# Altium project AWH6_V10.PrjPcb (part 3 of 3)
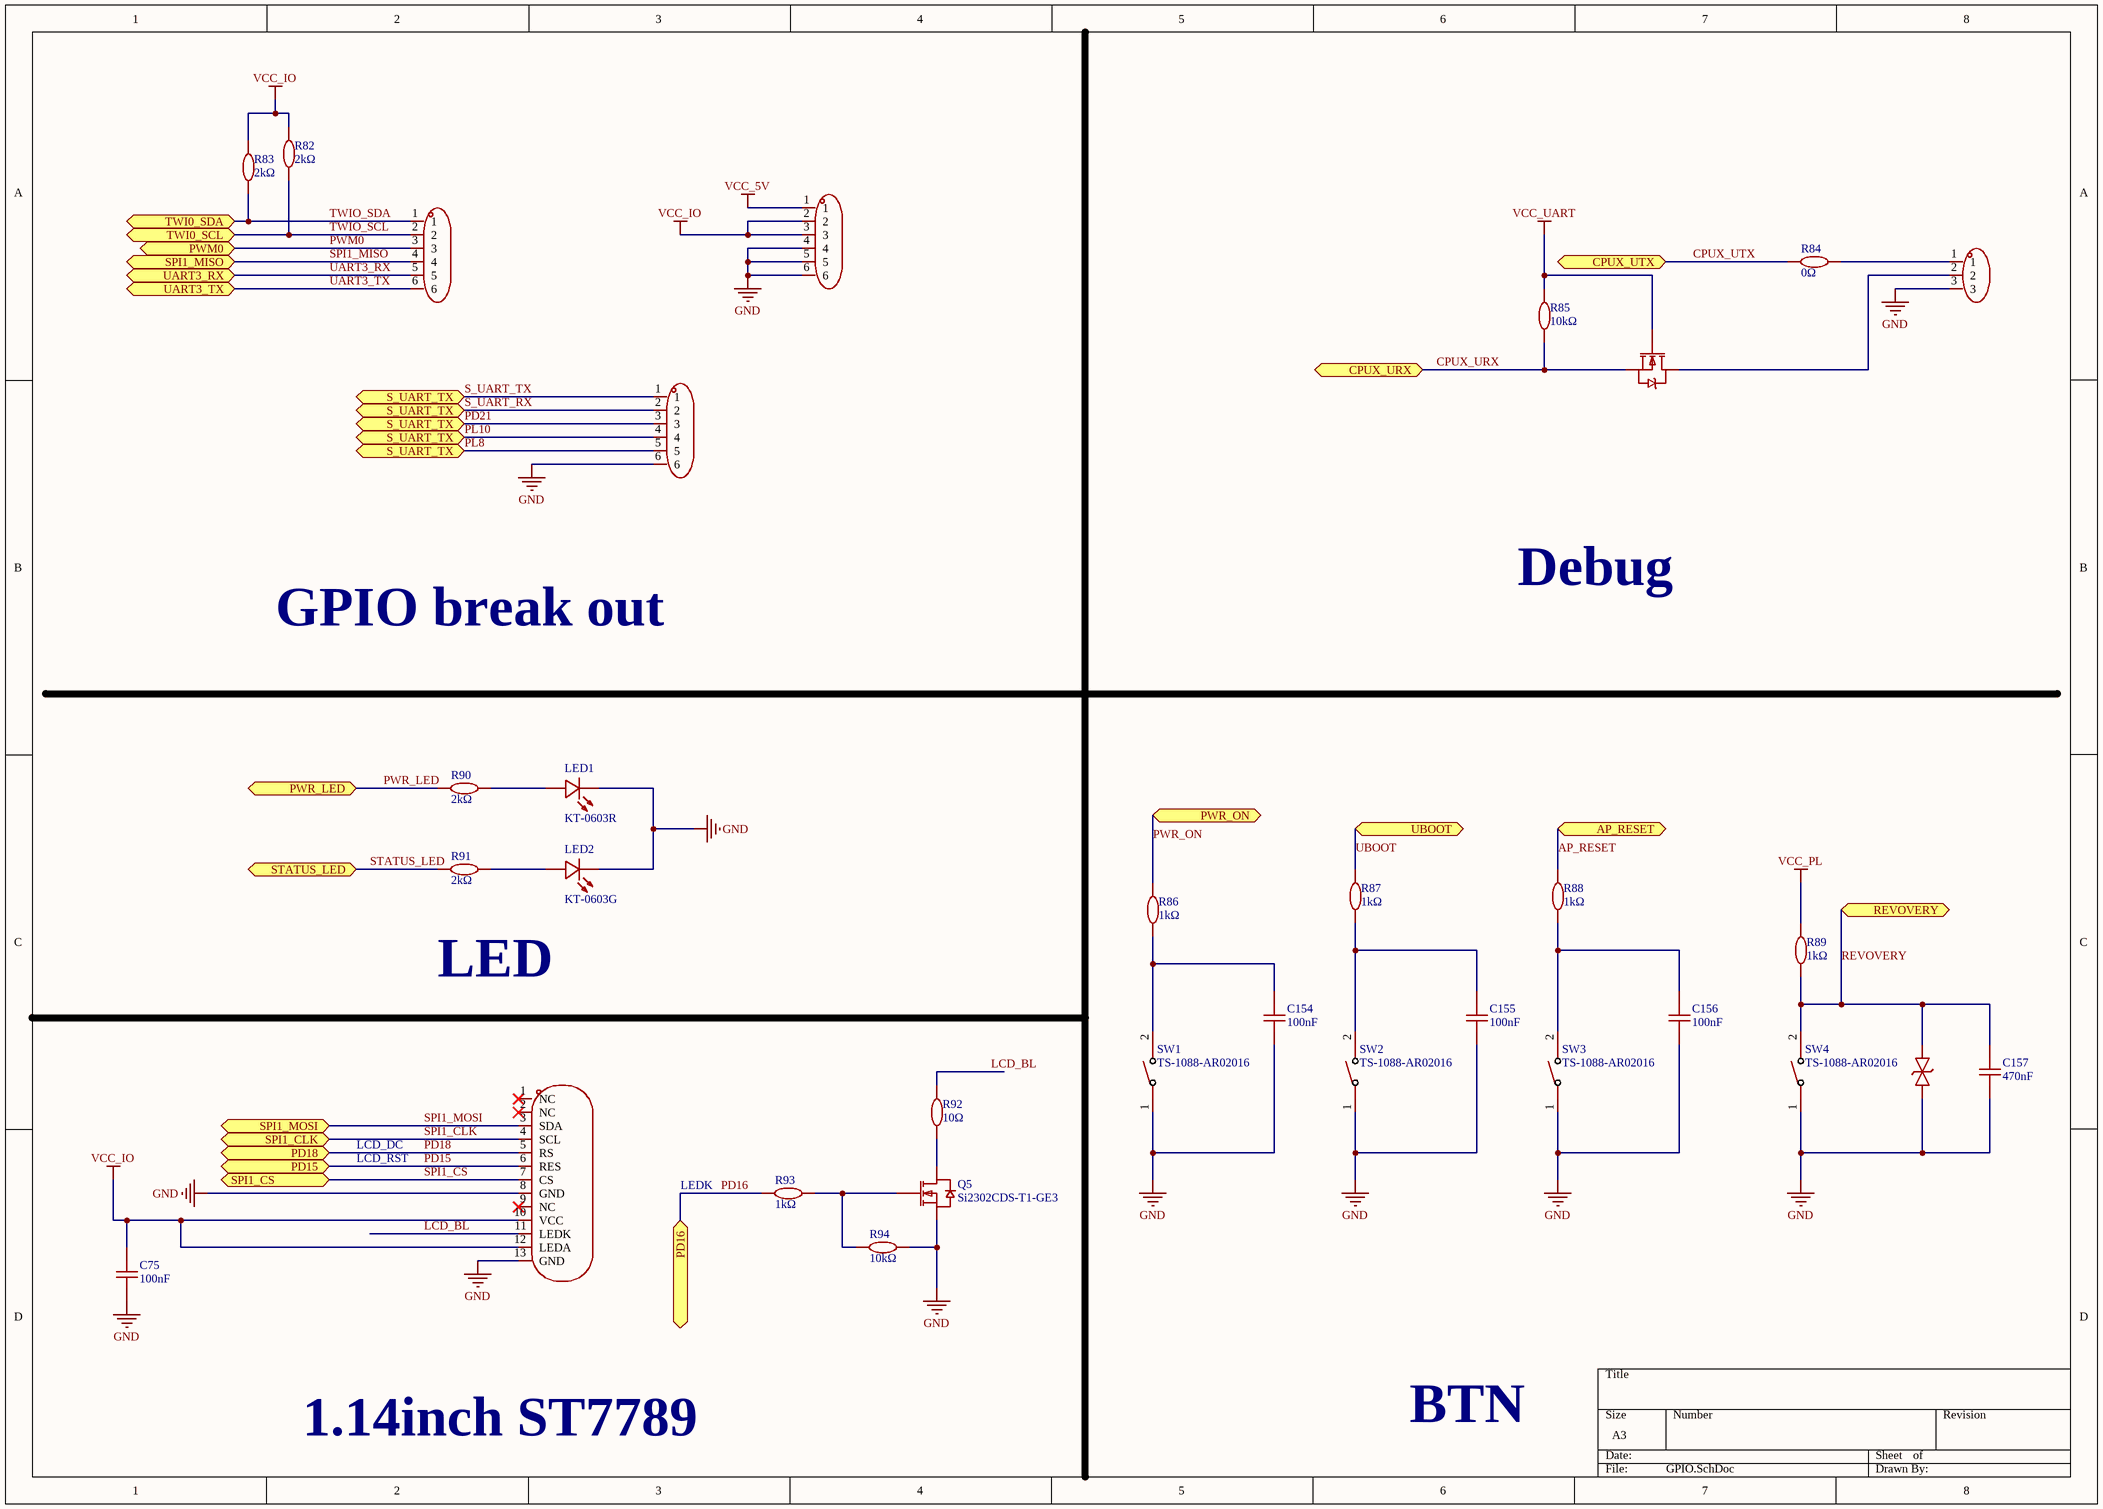
[diagram p10: GPIO.SchDoc]

## Nets that join several sheets
ALDO1: SoC_1 (C99.2 U2.H18), Power (5 pins), GPIO (R89.2)
ALDO2: Power (C66.2 U4.31), SoC_2 (10 pins)
ALDO3: SoC_1 (R70.1 U2.R6), eMMC (6 pins), Power (5 pins), TF-USB (R53.2), Audio-HDMI (5 pins), SoC_2 (5 pins), GPIO (9 pins)
BLDO1: LPDDR3 (12 pins), Power (C72.2 U4.2), SoC_2 (6 pins)
BLDO2: Power (C73.2 R49.1 U4.1), SoC_2 (5 pins)
GND: LPDDR3 (93 pins), SoC_1 (5 pins), eMMC (18 pins), Power (49 pins), TF-USB (47 pins), Audio-HDMI (21 pins), Wi-Fi (29 pins), SoC_2 (209 pins), GPIO (21 pins)
PS: Power (27 pins), TF-USB (9 pins), Audio-HDMI (D4.2), Wi-Fi (C90.2 C91.2 U30.4), GPIO (U12.1)
VCC18_RTC: Power (5 pins), SoC_2 (C149.2 R75.1 U2.F20)
VCC33_WIFI: Power (R51.1), Wi-Fi (6 pins)
VCC_DCXOIO: SoC_1 (C98.2 C100.2 U2.H6 U2.M19), Power (R47.1 R50.1), Wi-Fi (13 pins), SoC_2 (C126.2 U2.A22)
VCC_PC: SoC_1 (C97.2 U2.N19), eMMC (8 pins), Power (R48.1 R49.2)
VDD09_HDMI: Power (C69.2 L5.2 U4.9), SoC_2 (19 pins)
VDD18_LPDDR: LPDDR3 (C19.2 C20.2), Power (R39.2)
VDD_CPU: Power (C56.2 C61.2 L2.2 L3.2), SoC_2 (15 pins)
VDD_GPU: Power (C63.2 L4.2), SoC_2 (13 pins)
AP_CK32KO: Wi-Fi (R29.2 R30.2), SoC_2 (U2.G20)
AP_NMI: Power (R43.2 U4.16), SoC_2 (C102.2 U2.G21)
AP_RESET: Power (C57.2 U4.15), SoC_2 (C103.2 R75.2 U2.G22 U32.2), GPIO (R88.2)
AP_WAKE_BT: SoC_1 (U2.L22), Wi-Fi (R31.2 U6.6)
BT_PCM_CLK: SoC_1 (U2.K2), Wi-Fi (U6.26)
BT_PCM_DIN: SoC_1 (U2.L3), Wi-Fi (U6.27)
BT_PCM_DOUT: SoC_1 (U2.L4), Wi-Fi (U6.25)
BT_PCM_SYNC: SoC_1 (U2.K3), Wi-Fi (U6.28)
BT_REG_ON: SoC_1 (U2.L19), Wi-Fi (R23.2 R32.2)
BT_UART_CTS: SoC_1 (U2.H3), Wi-Fi (R18.1 U6.44)
BT_UART_RTS: SoC_1 (U2.K1), Wi-Fi (R21.1 U6.41)
BT_UART_RX: SoC_1 (U2.H4), Wi-Fi (R19.1 U6.43)
BT_UART_TX: SoC_1 (U2.J6), Wi-Fi (R20.1 U6.42)
BT_WAKE_AP: SoC_1 (U2.L21), Wi-Fi (U6.7)
CPUX_URX: SoC_1 (U2.D12), GPIO (Q4.2 R85.1)
CPUX_UTX: SoC_1 (U2.C9), GPIO (R84.1)
DDC_CEC_EN: SoC_1 (U2.E11), Audio-HDMI (R12.1)
EMMC_CLK: SoC_1 (C43.2 R34.1), eMMC (U3.M6)
EMMC_CMD: SoC_1 (U2.M21), eMMC (R37.1 U3.M5)
EMMC_D0: SoC_1 (U2.N22), eMMC (U3.A3)
EMMC_D1: SoC_1 (U2.N23), eMMC (U3.A4)
EMMC_D2: SoC_1 (U2.R22), eMMC (U3.A5)
EMMC_D3: SoC_1 (U2.R23), eMMC (U3.B2)
EMMC_D4: SoC_1 (U2.T22), eMMC (U3.B3 U3.C3)
EMMC_D5: SoC_1 (U2.T21), eMMC (U3.B4)
EMMC_D6: SoC_1 (U2.U19), eMMC (U3.B5 U3.C5)
EMMC_D7: SoC_1 (U2.U21), eMMC (U3.B6)
EMMC_DS: SoC_1 (U2.R20), eMMC (R38.2 U3.H5)
EMMC_RST: SoC_1 (R36.1), eMMC (U3.K5)
HCEC: SoC_1 (U2.E9), Audio-HDMI (Q3.2 R16.1)
HHPD: Audio-HDMI (C35.2 R15.1), SoC_2 (U2.C20)
HOST3_N: TF-USB (U24.2 USB1.2), SoC_2 (U2.A12)
HOST3_P: TF-USB (U25.2 USB1.3), SoC_2 (U2.B12)
HSCL: SoC_1 (U2.E10), Audio-HDMI (Q1.2 R10.1)
HSDA: SoC_1 (U2.F7), Audio-HDMI (Q2.2 R13.1)
HTX0_N: Audio-HDMI (CN1.9 D2.2 D2.9), SoC_2 (U2.B19)
HTX0_P: Audio-HDMI (CN1.7 D2.1 D2.10), SoC_2 (U2.A19)
HTX1_N: Audio-HDMI (CN1.6 D1.5 D1.6), SoC_2 (U2.B18)
HTX1_P: Audio-HDMI (CN1.4 D1.4 D1.7), SoC_2 (U2.A18)
HTX2_N: Audio-HDMI (CN1.3 D1.2 D1.9), SoC_2 (U2.B17)
HTX2_P: Audio-HDMI (CN1.1 D1.1 D1.10), SoC_2 (U2.A17)
HTXC_N: Audio-HDMI (CN1.12 D2.5 D2.6), SoC_2 (U2.B20)
HTXC_P: Audio-HDMI (CN1.10 D2.4 D2.7), SoC_2 (U2.A20)
LINEOUTL: Audio-HDMI (C34.2), SoC_2 (U2.D2)
LINEOUTR: Audio-HDMI (C33.2), SoC_2 (U2.D1)
PD15: SoC_1 (U2.R3), GPIO (LCD1.6)
PD16: SoC_1 (U2.R2), GPIO (R93.2)
PD18: SoC_1 (U2.P4), GPIO (LCD1.5)
PD21: SoC_1 (5 pins), GPIO (5 pins)
PMU_SCK: SoC_1 (U2.K20), Power (R45.1 U4.23)
PMU_SDA: SoC_1 (U2.K23), Power (R44.1 U4.24)
PWM0: SoC_1 (U2.U2), GPIO (U33.3)
PWR_LED: SoC_1 (U2.K21), GPIO (R90.1)
PWR_ON: Power (U4.27), GPIO (R86.2)
REVOVERY: SoC_1 (U2.J22), GPIO (C157.2 R89.1 SW4.2 U35.2)
SDC0_CLK: SoC_1 (R33.2), TF-USB (U5.5 U21.2)
SDC0_CMD: SoC_1 (U2.G3), TF-USB (R52.1 U5.3 U20.2)
SDC0_D0: SoC_1 (U2.F3), TF-USB (U5.7 U16.2)
SDC0_D1: SoC_1 (U2.E2), TF-USB (U5.8 U17.2)
SDC0_D2: SoC_1 (U2.G2), TF-USB (U5.1 U18.2)
SDC0_D3: SoC_1 (U2.F1), TF-USB (U5.2 U19.2)
SDC0_DET: SoC_1 (U2.C8), TF-USB (R56.1 U5.9 U22.2)
SPI1_CLK: SoC_1 (U2.E12), GPIO (LCD1.4)
SPI1_CS: SoC_1 (U2.D11), GPIO (LCD1.7)
SPI1_MISO: SoC_1 (U2.D9), GPIO (U33.4)
SPI1_MOSI: SoC_1 (U2.F9), GPIO (LCD1.3)
STATUS_LED: SoC_1 (U2.J21), GPIO (R91.1)
TWIO_SCL: SoC_1 (U2.U3), GPIO (R82.1 U33.2)
TWIO_SDA: SoC_1 (U2.R5), GPIO (R83.1 U33.1)
UART3_RX: SoC_1 (U2.V1), GPIO (U33.5)
UART3_TX: SoC_1 (U2.U5), GPIO (U33.6)
UBOOT: SoC_2 (U2.G17), GPIO (R87.2)
USB0_DRVVBUS: SoC_1 (U2.H20), TF-USB (R54.1 R57.2 U13.4)
USB0_N: TF-USB (U15.2 USB2.2), SoC_2 (U2.A13)
USB0_P: TF-USB (U14.2 USB2.3), SoC_2 (U2.B13)
USB1_N: TF-USB (U27.2 USB1.11), SoC_2 (U2.B16)
USB1_P: TF-USB (U28.2 USB1.12), SoC_2 (U2.C16)
USB1_SSRX_N: TF-USB (D6.1 D6.10 USB1.14), SoC_2 (U2.A14)
USB1_SSRX_P: TF-USB (D6.2 D6.9 USB1.15), SoC_2 (U2.B14)
USB1_SSTX_N: TF-USB (D6.4 D6.7 USB1.17), SoC_2 (C44.1)
USB1_SSTX_P: TF-USB (D6.5 D6.6 USB1.18), SoC_2 (C45.1)
VDD_CPUFB: Power (U4.39 U4.40), SoC_2 (U2.R16 U2.T17)
VDD_GPUFB: Power (U4.47), SoC_2 (U2.R7)
WIFI_PWR_EN: SoC_1 (U2.F8), Wi-Fi (R66.1)
WL_REG_ON: SoC_1 (U2.M22), Wi-Fi (R22.2 U6.12)
WL_SDIO_CLK: SoC_1 (R35.2), Wi-Fi (U6.17)
WL_SDIO_CMD: SoC_1 (U2.J3), Wi-Fi (R26.2 U6.16)
WL_SDIO_D0: SoC_1 (U2.J5), Wi-Fi (R25.2 U6.18)
WL_SDIO_D1: SoC_1 (U2.H2), Wi-Fi (R24.2 U6.19)
WL_SDIO_D2: SoC_1 (U2.L5), Wi-Fi (R28.2 U6.14)
WL_SDIO_D3: SoC_1 (U2.H5), Wi-Fi (R27.2 U6.15)
WL_WAKE_AP: SoC_1 (U2.L20), Wi-Fi (U6.13)